# EAGLE schematic sasa5 (EAGLE 7.5.0)
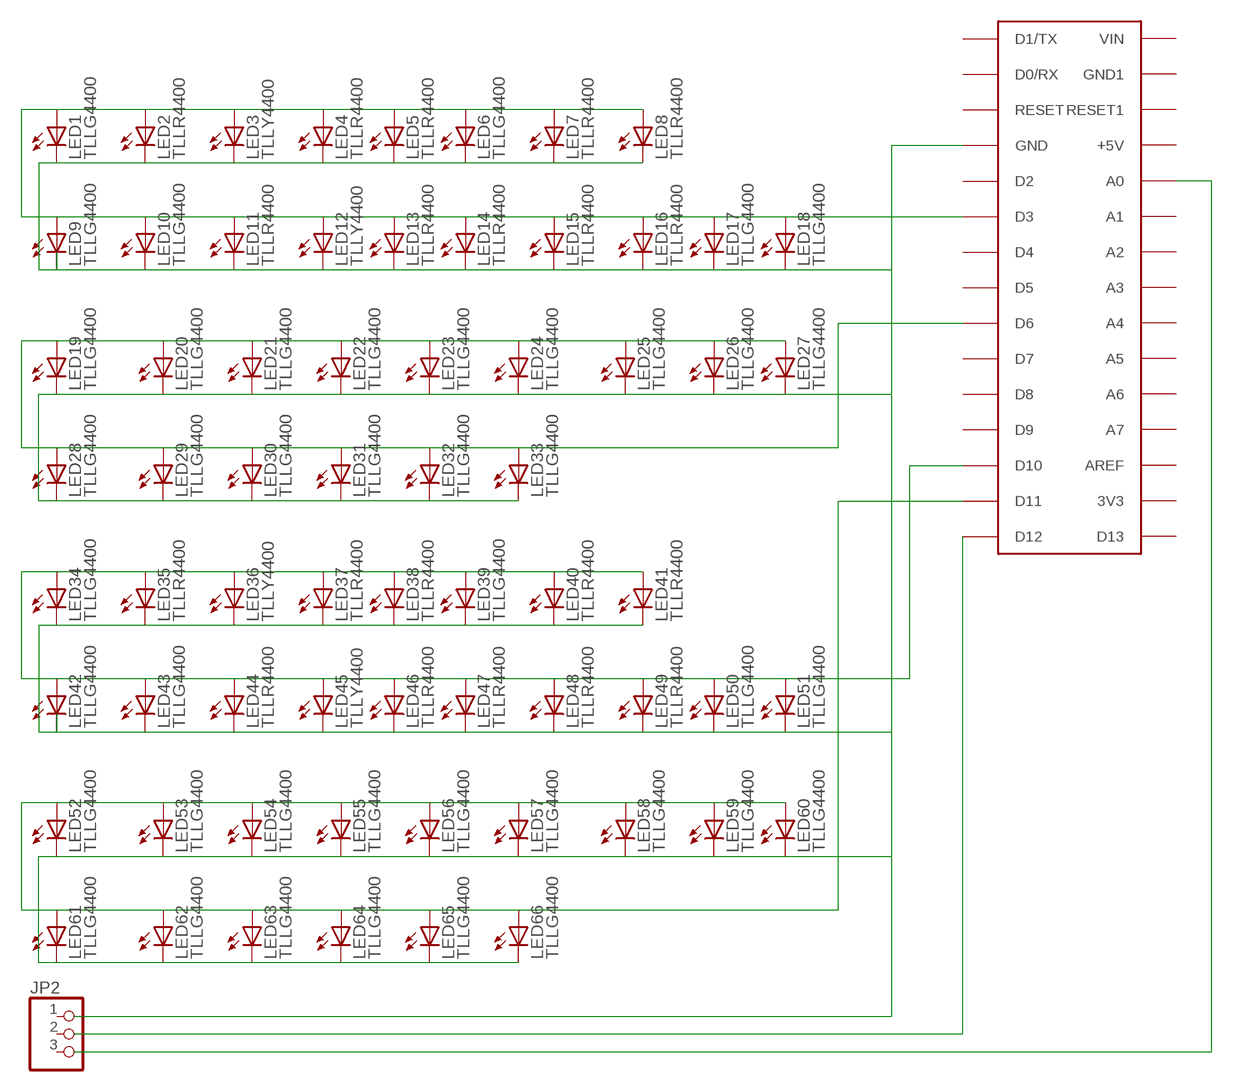
[diagram p0: schematic, sheet 1]

## Parts
JP2  PINHD-1X3  [1X03]
LED1  TLLG4400  [LED3MM]
LED2  TLLR4400  [LED3MM]
LED3  TLLY4400  [LED3MM]
LED4  TLLR4400  [LED3MM]
LED5  TLLR4400  [LED3MM]
LED6  TLLG4400  [LED3MM]
LED7  TLLR4400  [LED3MM]
LED8  TLLR4400  [LED3MM]
LED9  TLLG4400  [LED3MM]
LED10  TLLG4400  [LED3MM]
LED11  TLLR4400  [LED3MM]
LED12  TLLY4400  [LED3MM]
LED13  TLLR4400  [LED3MM]
LED14  TLLR4400  [LED3MM]
LED15  TLLR4400  [LED3MM]
LED16  TLLR4400  [LED3MM]
LED17  TLLG4400  [LED3MM]
LED18  TLLG4400  [LED3MM]
LED19  TLLG4400  [LED3MM]
LED20  TLLG4400  [LED3MM]
LED21  TLLG4400  [LED3MM]
LED22  TLLG4400  [LED3MM]
LED23  TLLG4400  [LED3MM]
LED24  TLLG4400  [LED3MM]
LED25  TLLG4400  [LED3MM]
LED26  TLLG4400  [LED3MM]
LED27  TLLG4400  [LED3MM]
LED28  TLLG4400  [LED3MM]
LED29  TLLG4400  [LED3MM]
LED30  TLLG4400  [LED3MM]
LED31  TLLG4400  [LED3MM]
LED32  TLLG4400  [LED3MM]
LED33  TLLG4400  [LED3MM]
LED34  TLLG4400  [LED3MM]
LED35  TLLR4400  [LED3MM]
LED36  TLLY4400  [LED3MM]
LED37  TLLR4400  [LED3MM]
LED38  TLLR4400  [LED3MM]
LED39  TLLG4400  [LED3MM]
LED40  TLLR4400  [LED3MM]
LED41  TLLR4400  [LED3MM]
LED42  TLLG4400  [LED3MM]
LED43  TLLG4400  [LED3MM]
LED44  TLLR4400  [LED3MM]
LED45  TLLY4400  [LED3MM]
LED46  TLLR4400  [LED3MM]
LED47  TLLR4400  [LED3MM]
LED48  TLLR4400  [LED3MM]
LED49  TLLR4400  [LED3MM]
LED50  TLLG4400  [LED3MM]
LED51  TLLG4400  [LED3MM]
LED52  TLLG4400  [LED3MM]
LED53  TLLG4400  [LED3MM]
LED54  TLLG4400  [LED3MM]
LED55  TLLG4400  [LED3MM]
LED56  TLLG4400  [LED3MM]
LED57  TLLG4400  [LED3MM]
LED58  TLLG4400  [LED3MM]
LED59  TLLG4400  [LED3MM]
LED60  TLLG4400  [LED3MM]
LED61  TLLG4400  [LED3MM]
LED62  TLLG4400  [LED3MM]
LED63  TLLG4400  [LED3MM]
LED64  TLLG4400  [LED3MM]
LED65  TLLG4400  [LED3MM]
LED66  TLLG4400  [LED3MM]
U$4  ARDUINONANO  [PDIP-32]

## Nets
N$1: LED19.A LED20.A LED21.A LED22.A LED23.A LED24.A LED25.A LED26.A LED27.A LED28.A LED29.A LED30.A LED31.A LED32.A LED33.A U$4.D6
N$2: LED34.A LED35.A LED36.A LED37.A LED38.A LED39.A LED40.A LED41.A LED42.A LED43.A LED44.A LED45.A LED46.A LED47.A LED48.A LED49.A LED50.A LED51.A U$4.D10
N$3: LED1.A LED2.A LED3.A LED4.A LED5.A LED6.A LED7.A LED8.A LED9.A LED10.A LED11.A LED12.A LED13.A LED14.A LED15.A LED16.A LED17.A LED18.A U$4.D3
N$4: U$4.D12
N$5: LED52.A LED53.A LED54.A LED55.A LED56.A LED57.A LED58.A LED59.A LED60.A LED61.A LED62.A LED63.A LED64.A LED65.A LED66.A U$4.D11
N$6: LED1.K(C) LED2.K(C) LED3.K(C) LED4.K(C) LED5.K(C) LED6.K(C) LED7.K(C) LED8.K(C) LED9.K(C) LED10.K(C) LED11.K(C) LED12.K(C) LED13.K(C) LED14.K(C) LED15.K(C) LED16.K(C) LED17.K(C) LED18.K(C) LED19.K(C) LED20.K(C) LED21.K(C) LED22.K(C) LED23.K(C) LED24.K(C) LED25.K(C) LED26.K(C) LED27.K(C) LED28.K(C) LED29.K(C) LED30.K(C) LED31.K(C) LED32.K(C) LED33.K(C) LED34.K(C) LED35.K(C) LED36.K(C) LED37.K(C) LED38.K(C) LED39.K(C) LED40.K(C) LED41.K(C) LED42.K(C) LED43.K(C) LED44.K(C) LED45.K(C) LED46.K(C) LED47.K(C) LED48.K(C) LED49.K(C) LED50.K(C) LED51.K(C) LED52.K(C) LED53.K(C) LED54.K(C) LED55.K(C) LED56.K(C) LED57.K(C) LED58.K(C) LED59.K(C) LED60.K(C) LED61.K(C) LED62.K(C) LED63.K(C) LED64.K(C) LED65.K(C) LED66.K(C) U$4.GND
N$7: U$4.A0
Unconnected: JP2.1 JP2.2 JP2.3 U$4.3V3 U$4.+5V U$4.A1 U$4.A2 U$4.A3 U$4.A4 U$4.A5 U$4.A6 U$4.A7 U$4.AREF U$4.D0/RX U$4.D1/TX U$4.D2 U$4.D4 U$4.D5 U$4.D7 U$4.D8 U$4.D9 U$4.D13 U$4.GND1 U$4.RESET U$4.RESET1 U$4.VIN

## Library data of the parts
JP2 = adafruit:PINHD-1X3: PIN HEADER
LED1 LED6 LED9 LED10 LED17-LED34 LED39 LED42 LED43 LED50-LED66 = led:TLLG4400: Low Current (2mA) LED 3 mm Tinted Diffused Package color GREEN Source: Data sheet <http://www.farnell.com/datasheets/391098.pdf>; MF: VISHAY SEMICONDUCTOR; OC_FARNELL: 1612435
LED2 LED4 LED5 LED7 LED8 LED11 LED13-LED16 LED35 LED37 LED38 LED40 LED41 LED44 LED46-LED49 = led:TLLR4400: Low Current (2mA) LED 3 mm Tinted Diffused Package color RED Source: Data sheet <http://www.farnell.com/datasheets/391100.pdf>; MF: VISHAY SEMICONDUCTOR; OC_FARNELL: 1612437
LED3 LED12 LED36 LED45 = led:TLLY4400: Low Current (2mA) LED 3 mm Tinted Diffused Package color YELLOW Source: Data sheet <http://www.farnell.com/datasheets/391098.pdf>; MF: VISHAY SEMICONDUCTOR; OC_FARNELL: 1612439
U$4 = jet-lib:ARDUINONANO